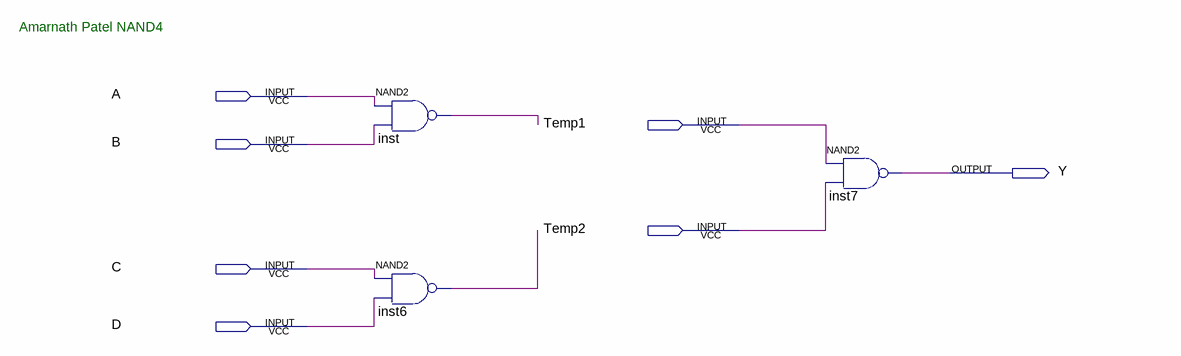
[diagram p0: schematic sheet]
// Quartus schematic NAND4_AmarnathPatel.bdf as structural Verilog: 3 symbols, 7 pins
module NAND4_AmarnathPatel (
  input  A,
  input  Temp1,
  input  B,
  input  Temp2,
  input  C,
  input  D,
  output Y
);

  wire inst6_out, inst_out;

  nand inst (inst_out, A, B);
  nand inst6 (inst6_out, C, D);
  nand inst7 (Y, Temp1, Temp2);

  // Notes on the sheet:
  //   Amarnath Patel NAND4
endmodule
